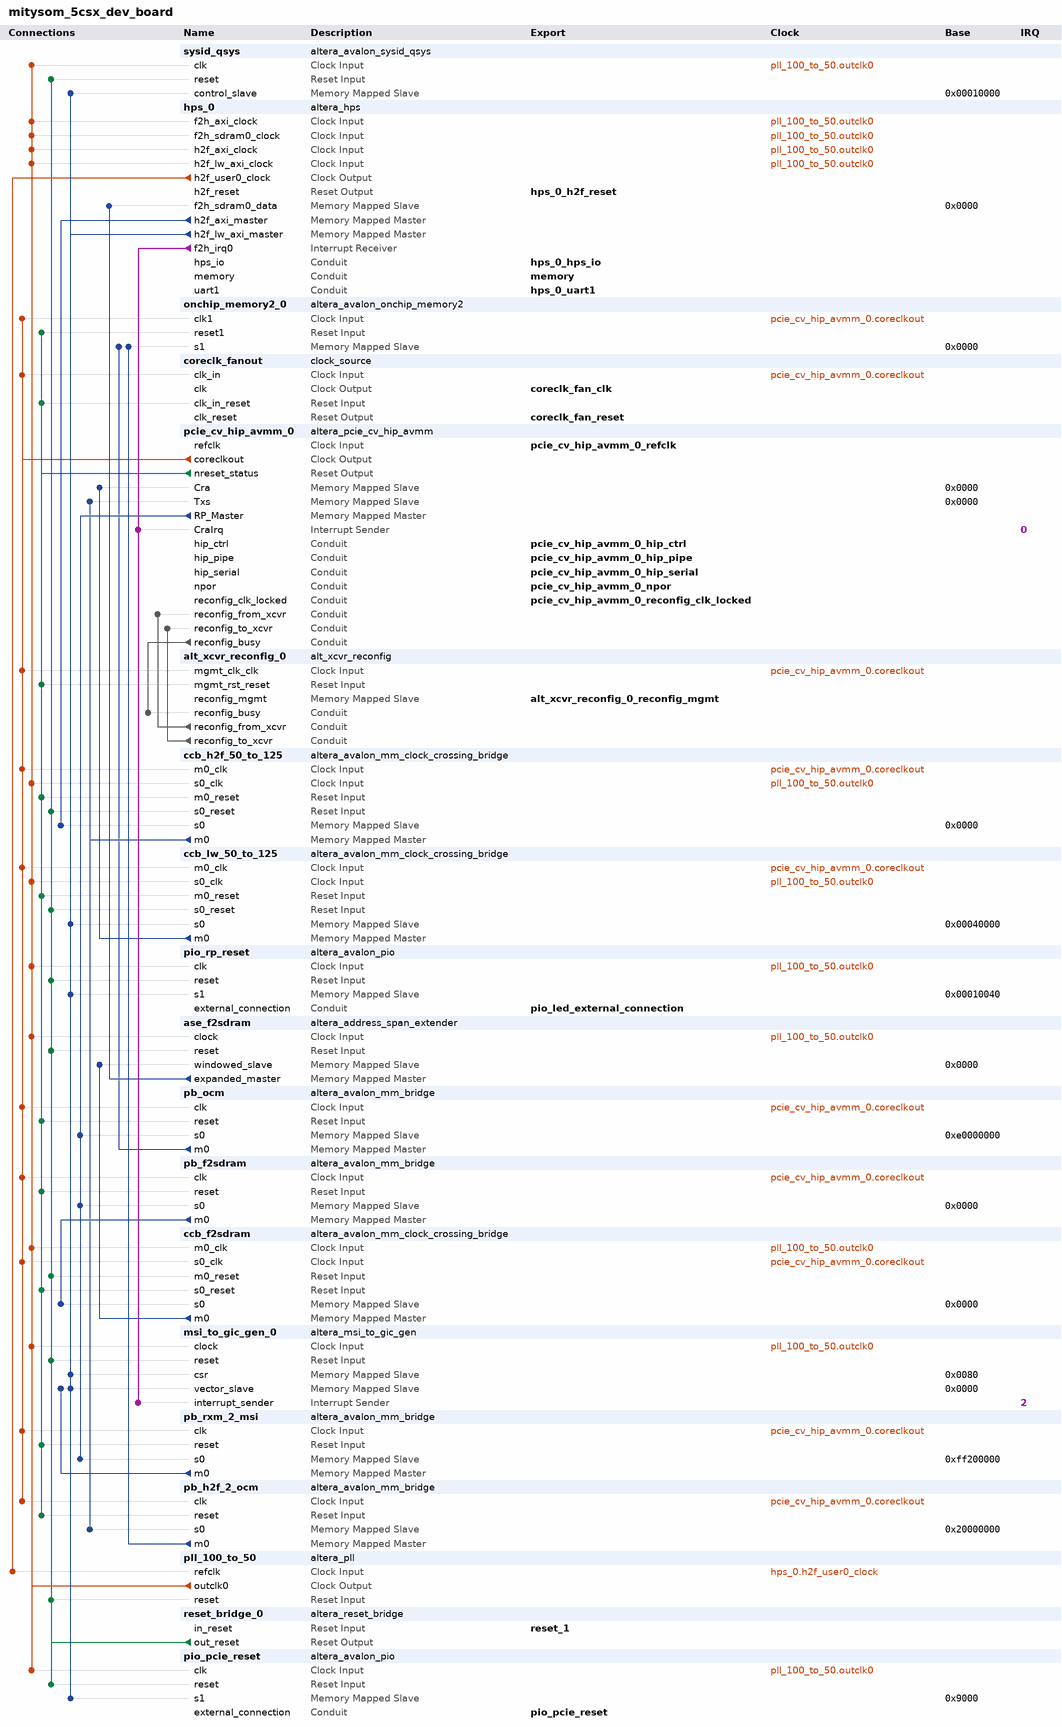
[diagram p0: system contents]
# Platform Designer (Qsys) system mitysom_5csx_dev_board, Cyclone V 5CSXFC6C6U23C7
# Parameters at their usual value, and those the tool derives, are not listed.
package require -exact qsys 13.1
create_system mitysom_5csx_dev_board
set_project_property DEVICE_FAMILY {Cyclone V}
set_project_property DEVICE 5CSXFC6C6U23C7

add_instance sysid_qsys altera_avalon_sysid_qsys 13.1
set_instance_parameter_value sysid_qsys id 65548

add_instance hps_0 altera_hps 13.1
set_instance_parameter_value hps_0 MEM_VENDOR JEDEC
set_instance_parameter_value hps_0 MEM_ROW_ADDR_WIDTH 15
set_instance_parameter_value hps_0 MEM_COL_ADDR_WIDTH 10
set_instance_parameter_value hps_0 MEM_DQ_WIDTH 40
set_instance_parameter_value hps_0 MEM_BANKADDR_WIDTH 3
set_instance_parameter_value hps_0 MEM_DRV_STR RZQ/7
set_instance_parameter_value hps_0 MEM_RTT_NOM {ODT Disabled}
set_instance_parameter_value hps_0 MEM_RTT_WR RZQ/4
set_instance_parameter_value hps_0 MEM_WTCL 6
set_instance_parameter_value hps_0 MEM_TCL 7
set_instance_parameter_value hps_0 TIMING_TIS 175
set_instance_parameter_value hps_0 TIMING_TIH 120
set_instance_parameter_value hps_0 TIMING_TDS 10
set_instance_parameter_value hps_0 TIMING_TDH 45
set_instance_parameter_value hps_0 TIMING_TDQSQ 100
set_instance_parameter_value hps_0 TIMING_TDQSCK 225
set_instance_parameter_value hps_0 TIMING_TDQSS 0.27
set_instance_parameter_value hps_0 TIMING_TQSH 0.4
set_instance_parameter_value hps_0 TIMING_TDSH 0.18
set_instance_parameter_value hps_0 TIMING_TDSS 0.18
set_instance_parameter_value hps_0 MEM_TRAS_NS 35.0
set_instance_parameter_value hps_0 MEM_TRCD_NS 13.75
set_instance_parameter_value hps_0 MEM_TRP_NS 13.75
set_instance_parameter_value hps_0 MEM_TRFC_NS 260.0
set_instance_parameter_value hps_0 MEM_TFAW_NS 30.0
set_instance_parameter_value hps_0 MEM_TRRD_NS 10.0
set_instance_parameter_value hps_0 MEM_TRTP_NS 10.0
set_instance_parameter_value hps_0 REF_CLK_FREQ 25.0
set_instance_parameter_value hps_0 DEFAULT_FAST_SIM_MODEL true
set_instance_parameter_value hps_0 MEM_VOLTAGE {1.35V DDR3L}
set_instance_parameter_value hps_0 TIMING_BOARD_MAX_CK_DELAY 0.6
set_instance_parameter_value hps_0 TIMING_BOARD_MAX_DQS_DELAY 0.2
set_instance_parameter_value hps_0 TIMING_BOARD_SKEW_CKDQS_DIMM_MIN 0.092
set_instance_parameter_value hps_0 TIMING_BOARD_SKEW_CKDQS_DIMM_MAX 0.215
set_instance_parameter_value hps_0 TIMING_BOARD_SKEW_WITHIN_DQS 0.0
set_instance_parameter_value hps_0 TIMING_BOARD_SKEW_BETWEEN_DQS 0.01
set_instance_parameter_value hps_0 TIMING_BOARD_DQ_TO_DQS_SKEW 0.0
set_instance_parameter_value hps_0 TIMING_BOARD_AC_SKEW 0.0
set_instance_parameter_value hps_0 TIMING_BOARD_AC_TO_CK_SKEW 0.0
set_instance_parameter_value hps_0 MEM_CLK_FREQ 400.0
set_instance_parameter_value hps_0 HPS_PROTOCOL DDR3
set_instance_parameter_value hps_0 STM_Enable false
set_instance_parameter_value hps_0 F2S_Width 2
set_instance_parameter_value hps_0 S2F_Width 2
set_instance_parameter_value hps_0 LWH2F_Enable true
set_instance_parameter_value hps_0 F2SDRAM_Type {Avalon-MM Bidirectional}
set_instance_parameter_value hps_0 F2SDRAM_Width 64
set_instance_parameter_value hps_0 F2SCLK_DBGRST_Enable false
set_instance_parameter_value hps_0 F2SCLK_WARMRST_Enable false
set_instance_parameter_value hps_0 F2SCLK_COLDRST_Enable false
set_instance_parameter_value hps_0 F2SINTERRUPT_Enable true
set_instance_parameter_value hps_0 EMAC1_PinMuxing {HPS I/O Set 0}
set_instance_parameter_value hps_0 EMAC1_Mode RGMII
set_instance_parameter_value hps_0 QSPI_PinMuxing {HPS I/O Set 1}
set_instance_parameter_value hps_0 QSPI_Mode {2 SS}
set_instance_parameter_value hps_0 SDIO_PinMuxing {HPS I/O Set 0}
set_instance_parameter_value hps_0 SDIO_Mode {4-bit Data}
set_instance_parameter_value hps_0 USB1_PinMuxing Unused
set_instance_parameter_value hps_0 USB1_Mode N/A
set_instance_parameter_value hps_0 SPIM1_PinMuxing Unused
set_instance_parameter_value hps_0 SPIM1_Mode N/A
set_instance_parameter_value hps_0 UART0_PinMuxing {HPS I/O Set 2}
set_instance_parameter_value hps_0 UART0_Mode {No Flow Control}
set_instance_parameter_value hps_0 UART1_PinMuxing FPGA
set_instance_parameter_value hps_0 UART1_Mode Full
set_instance_parameter_value hps_0 I2C0_PinMuxing {HPS I/O Set 1}
set_instance_parameter_value hps_0 I2C0_Mode I2C
set_instance_parameter_value hps_0 I2C1_PinMuxing {HPS I/O Set 1}
set_instance_parameter_value hps_0 I2C1_Mode I2C
set_instance_parameter_value hps_0 S2FCLK_USER0CLK_Enable true
set_instance_parameter_value hps_0 S2FCLK_USER1CLK_FREQ 100
set_instance_parameter_value hps_0 FPGA_PERIPHERAL_OUTPUT_CLOCK_FREQ_EMAC0_MD_CLK 100
set_instance_parameter_value hps_0 FPGA_PERIPHERAL_OUTPUT_CLOCK_FREQ_EMAC0_GTX_CLK 100
set_instance_parameter_value hps_0 FPGA_PERIPHERAL_OUTPUT_CLOCK_FREQ_EMAC1_MD_CLK 100
set_instance_parameter_value hps_0 FPGA_PERIPHERAL_OUTPUT_CLOCK_FREQ_EMAC1_GTX_CLK 100

add_instance onchip_memory2_0 altera_avalon_onchip_memory2 13.1
set_instance_parameter_value onchip_memory2_0 dataWidth 64
set_instance_parameter_value onchip_memory2_0 dualPort false
set_instance_parameter_value onchip_memory2_0 initMemContent true
set_instance_parameter_value onchip_memory2_0 initializationFileName onchip_memory2_0
set_instance_parameter_value onchip_memory2_0 memorySize 262144

add_instance coreclk_fanout clock_source 13.1
set_instance_parameter_value coreclk_fanout clockFrequency 125000000

add_instance pcie_cv_hip_avmm_0 altera_pcie_cv_hip_avmm 13.1
set_instance_parameter_value pcie_cv_hip_avmm_0 pcie_qsys 1
set_instance_parameter_value pcie_cv_hip_avmm_0 altpcie_avmm_hwtcl 1
set_instance_parameter_value pcie_cv_hip_avmm_0 lane_mask_hwtcl x4
set_instance_parameter_value pcie_cv_hip_avmm_0 gen123_lane_rate_mode_hwtcl {Gen1 (2.5 Gbps)}
set_instance_parameter_value pcie_cv_hip_avmm_0 port_type_hwtcl {Root port}
set_instance_parameter_value pcie_cv_hip_avmm_0 rxbuffer_rxreq_hwtcl Balanced
set_instance_parameter_value pcie_cv_hip_avmm_0 pll_refclk_freq_hwtcl {100 MHz}
set_instance_parameter_value pcie_cv_hip_avmm_0 set_pld_clk_x1_625MHz_hwtcl 0
set_instance_parameter_value pcie_cv_hip_avmm_0 in_cvp_mode_hwtcl 0
set_instance_parameter_value pcie_cv_hip_avmm_0 SLAVE_ADDRESS_MAP_0 0
set_instance_parameter_value pcie_cv_hip_avmm_0 SLAVE_ADDRESS_MAP_1 0
set_instance_parameter_value pcie_cv_hip_avmm_0 SLAVE_ADDRESS_MAP_2 0
set_instance_parameter_value pcie_cv_hip_avmm_0 SLAVE_ADDRESS_MAP_3 0
set_instance_parameter_value pcie_cv_hip_avmm_0 SLAVE_ADDRESS_MAP_4 0
set_instance_parameter_value pcie_cv_hip_avmm_0 SLAVE_ADDRESS_MAP_5 0
set_instance_parameter_value pcie_cv_hip_avmm_0 NUM_PREFETCH_MASTERS 1
set_instance_parameter_value pcie_cv_hip_avmm_0 bar0_type_hwtcl 0
set_instance_parameter_value pcie_cv_hip_avmm_0 bar1_type_hwtcl 0
set_instance_parameter_value pcie_cv_hip_avmm_0 bar2_type_hwtcl 0
set_instance_parameter_value pcie_cv_hip_avmm_0 bar3_type_hwtcl 0
set_instance_parameter_value pcie_cv_hip_avmm_0 bar4_type_hwtcl 0
set_instance_parameter_value pcie_cv_hip_avmm_0 bar5_type_hwtcl 0
set_instance_parameter_value pcie_cv_hip_avmm_0 CB_P2A_AVALON_ADDR_B0 0x00000000
set_instance_parameter_value pcie_cv_hip_avmm_0 CB_P2A_AVALON_ADDR_B1 0x00000000
set_instance_parameter_value pcie_cv_hip_avmm_0 CB_P2A_AVALON_ADDR_B2 0x00000000
set_instance_parameter_value pcie_cv_hip_avmm_0 CB_P2A_AVALON_ADDR_B3 0x00000000
set_instance_parameter_value pcie_cv_hip_avmm_0 CB_P2A_AVALON_ADDR_B4 0x00000000
set_instance_parameter_value pcie_cv_hip_avmm_0 CB_P2A_AVALON_ADDR_B5 0x00000000
set_instance_parameter_value pcie_cv_hip_avmm_0 fixed_address_mode 0
set_instance_parameter_value pcie_cv_hip_avmm_0 CB_P2A_FIXED_AVALON_ADDR_B0 0
set_instance_parameter_value pcie_cv_hip_avmm_0 CB_P2A_FIXED_AVALON_ADDR_B1 0
set_instance_parameter_value pcie_cv_hip_avmm_0 CB_P2A_FIXED_AVALON_ADDR_B2 0
set_instance_parameter_value pcie_cv_hip_avmm_0 CB_P2A_FIXED_AVALON_ADDR_B3 0
set_instance_parameter_value pcie_cv_hip_avmm_0 CB_P2A_FIXED_AVALON_ADDR_B4 0
set_instance_parameter_value pcie_cv_hip_avmm_0 CB_P2A_FIXED_AVALON_ADDR_B5 0
set_instance_parameter_value pcie_cv_hip_avmm_0 vendor_id_hwtcl 4466
set_instance_parameter_value pcie_cv_hip_avmm_0 device_id_hwtcl 57344
set_instance_parameter_value pcie_cv_hip_avmm_0 revision_id_hwtcl 1
set_instance_parameter_value pcie_cv_hip_avmm_0 class_code_hwtcl 394240
set_instance_parameter_value pcie_cv_hip_avmm_0 subsystem_vendor_id_hwtcl 4466
set_instance_parameter_value pcie_cv_hip_avmm_0 subsystem_device_id_hwtcl 57344
set_instance_parameter_value pcie_cv_hip_avmm_0 max_payload_size_hwtcl 256
set_instance_parameter_value pcie_cv_hip_avmm_0 extend_tag_field_hwtcl 32
set_instance_parameter_value pcie_cv_hip_avmm_0 completion_timeout_hwtcl ABCD
set_instance_parameter_value pcie_cv_hip_avmm_0 enable_completion_timeout_disable_hwtcl 1
set_instance_parameter_value pcie_cv_hip_avmm_0 use_aer_hwtcl 0
set_instance_parameter_value pcie_cv_hip_avmm_0 ecrc_check_capable_hwtcl 0
set_instance_parameter_value pcie_cv_hip_avmm_0 ecrc_gen_capable_hwtcl 0
set_instance_parameter_value pcie_cv_hip_avmm_0 use_crc_forwarding_hwtcl 0
set_instance_parameter_value pcie_cv_hip_avmm_0 port_link_number_hwtcl 1
set_instance_parameter_value pcie_cv_hip_avmm_0 dll_active_report_support_hwtcl 0
set_instance_parameter_value pcie_cv_hip_avmm_0 surprise_down_error_support_hwtcl 0
set_instance_parameter_value pcie_cv_hip_avmm_0 slotclkcfg_hwtcl 1
set_instance_parameter_value pcie_cv_hip_avmm_0 msi_multi_message_capable_hwtcl 4
set_instance_parameter_value pcie_cv_hip_avmm_0 msi_64bit_addressing_capable_hwtcl true
set_instance_parameter_value pcie_cv_hip_avmm_0 msi_masking_capable_hwtcl false
set_instance_parameter_value pcie_cv_hip_avmm_0 msi_support_hwtcl true
set_instance_parameter_value pcie_cv_hip_avmm_0 enable_function_msix_support_hwtcl 0
set_instance_parameter_value pcie_cv_hip_avmm_0 msix_table_size_hwtcl 0
set_instance_parameter_value pcie_cv_hip_avmm_0 msix_table_offset_hwtcl 0
set_instance_parameter_value pcie_cv_hip_avmm_0 msix_table_bir_hwtcl 0
set_instance_parameter_value pcie_cv_hip_avmm_0 msix_pba_offset_hwtcl 0
set_instance_parameter_value pcie_cv_hip_avmm_0 msix_pba_bir_hwtcl 0
set_instance_parameter_value pcie_cv_hip_avmm_0 enable_slot_register_hwtcl 0
set_instance_parameter_value pcie_cv_hip_avmm_0 slot_power_scale_hwtcl 0
set_instance_parameter_value pcie_cv_hip_avmm_0 slot_power_limit_hwtcl 0
set_instance_parameter_value pcie_cv_hip_avmm_0 slot_number_hwtcl 0
set_instance_parameter_value pcie_cv_hip_avmm_0 endpoint_l0_latency_hwtcl 0
set_instance_parameter_value pcie_cv_hip_avmm_0 endpoint_l1_latency_hwtcl 0
set_instance_parameter_value pcie_cv_hip_avmm_0 CG_COMMON_CLOCK_MODE 1
set_instance_parameter_value pcie_cv_hip_avmm_0 avmm_width_hwtcl 64
set_instance_parameter_value pcie_cv_hip_avmm_0 AVALON_ADDR_WIDTH 32
set_instance_parameter_value pcie_cv_hip_avmm_0 CB_PCIE_MODE 0
set_instance_parameter_value pcie_cv_hip_avmm_0 CB_PCIE_RX_LITE 0
set_instance_parameter_value pcie_cv_hip_avmm_0 AST_LITE 0
set_instance_parameter_value pcie_cv_hip_avmm_0 CG_RXM_IRQ_NUM 16
set_instance_parameter_value pcie_cv_hip_avmm_0 bypass_tl false
set_instance_parameter_value pcie_cv_hip_avmm_0 CG_IMPL_CRA_AV_SLAVE_PORT 1
set_instance_parameter_value pcie_cv_hip_avmm_0 CG_ENABLE_ADVANCED_INTERRUPT 0
set_instance_parameter_value pcie_cv_hip_avmm_0 CG_ENABLE_A2P_INTERRUPT 0
set_instance_parameter_value pcie_cv_hip_avmm_0 CG_ENABLE_HIP_STATUS 0
set_instance_parameter_value pcie_cv_hip_avmm_0 CG_ENABLE_HIP_STATUS_EXTENSION 0
set_instance_parameter_value pcie_cv_hip_avmm_0 TX_S_ADDR_WIDTH 32
set_instance_parameter_value pcie_cv_hip_avmm_0 CB_A2P_ADDR_MAP_IS_FIXED 0
set_instance_parameter_value pcie_cv_hip_avmm_0 CB_A2P_ADDR_MAP_NUM_ENTRIES 2
set_instance_parameter_value pcie_cv_hip_avmm_0 CB_A2P_ADDR_MAP_PASS_THRU_BITS 28
set_instance_parameter_value pcie_cv_hip_avmm_0 BYPASSS_A2P_TRANSLATION 0
set_instance_parameter_value pcie_cv_hip_avmm_0 CB_RP_S_ADDR_WIDTH 32
set_instance_parameter_value pcie_cv_hip_avmm_0 CB_A2P_ADDR_MAP_FIXED_TABLE_0_HIGH 0
set_instance_parameter_value pcie_cv_hip_avmm_0 CB_A2P_ADDR_MAP_FIXED_TABLE_0_LOW 0
set_instance_parameter_value pcie_cv_hip_avmm_0 CB_A2P_ADDR_MAP_FIXED_TABLE_1_HIGH 0
set_instance_parameter_value pcie_cv_hip_avmm_0 CB_A2P_ADDR_MAP_FIXED_TABLE_1_LOW 0
set_instance_parameter_value pcie_cv_hip_avmm_0 CB_A2P_ADDR_MAP_FIXED_TABLE_2_HIGH 0
set_instance_parameter_value pcie_cv_hip_avmm_0 CB_A2P_ADDR_MAP_FIXED_TABLE_2_LOW 0
set_instance_parameter_value pcie_cv_hip_avmm_0 CB_A2P_ADDR_MAP_FIXED_TABLE_3_HIGH 0
set_instance_parameter_value pcie_cv_hip_avmm_0 CB_A2P_ADDR_MAP_FIXED_TABLE_3_LOW 0
set_instance_parameter_value pcie_cv_hip_avmm_0 CB_A2P_ADDR_MAP_FIXED_TABLE_4_HIGH 0
set_instance_parameter_value pcie_cv_hip_avmm_0 CB_A2P_ADDR_MAP_FIXED_TABLE_4_LOW 0
set_instance_parameter_value pcie_cv_hip_avmm_0 CB_A2P_ADDR_MAP_FIXED_TABLE_5_HIGH 0
set_instance_parameter_value pcie_cv_hip_avmm_0 CB_A2P_ADDR_MAP_FIXED_TABLE_5_LOW 0
set_instance_parameter_value pcie_cv_hip_avmm_0 CB_A2P_ADDR_MAP_FIXED_TABLE_6_HIGH 0
set_instance_parameter_value pcie_cv_hip_avmm_0 CB_A2P_ADDR_MAP_FIXED_TABLE_6_LOW 0
set_instance_parameter_value pcie_cv_hip_avmm_0 CB_A2P_ADDR_MAP_FIXED_TABLE_7_HIGH 0
set_instance_parameter_value pcie_cv_hip_avmm_0 CB_A2P_ADDR_MAP_FIXED_TABLE_7_LOW 0
set_instance_parameter_value pcie_cv_hip_avmm_0 CB_A2P_ADDR_MAP_FIXED_TABLE_8_HIGH 0
set_instance_parameter_value pcie_cv_hip_avmm_0 CB_A2P_ADDR_MAP_FIXED_TABLE_8_LOW 0
set_instance_parameter_value pcie_cv_hip_avmm_0 CB_A2P_ADDR_MAP_FIXED_TABLE_9_HIGH 0
set_instance_parameter_value pcie_cv_hip_avmm_0 CB_A2P_ADDR_MAP_FIXED_TABLE_9_LOW 0
set_instance_parameter_value pcie_cv_hip_avmm_0 CB_A2P_ADDR_MAP_FIXED_TABLE_10_HIGH 0
set_instance_parameter_value pcie_cv_hip_avmm_0 CB_A2P_ADDR_MAP_FIXED_TABLE_10_LOW 0
set_instance_parameter_value pcie_cv_hip_avmm_0 CB_A2P_ADDR_MAP_FIXED_TABLE_11_HIGH 0
set_instance_parameter_value pcie_cv_hip_avmm_0 CB_A2P_ADDR_MAP_FIXED_TABLE_11_LOW 0
set_instance_parameter_value pcie_cv_hip_avmm_0 CB_A2P_ADDR_MAP_FIXED_TABLE_12_HIGH 0
set_instance_parameter_value pcie_cv_hip_avmm_0 CB_A2P_ADDR_MAP_FIXED_TABLE_12_LOW 0
set_instance_parameter_value pcie_cv_hip_avmm_0 CB_A2P_ADDR_MAP_FIXED_TABLE_13_HIGH 0
set_instance_parameter_value pcie_cv_hip_avmm_0 CB_A2P_ADDR_MAP_FIXED_TABLE_13_LOW 0
set_instance_parameter_value pcie_cv_hip_avmm_0 CB_A2P_ADDR_MAP_FIXED_TABLE_14_HIGH 0
set_instance_parameter_value pcie_cv_hip_avmm_0 CB_A2P_ADDR_MAP_FIXED_TABLE_14_LOW 0
set_instance_parameter_value pcie_cv_hip_avmm_0 CB_A2P_ADDR_MAP_FIXED_TABLE_15_HIGH 0
set_instance_parameter_value pcie_cv_hip_avmm_0 CB_A2P_ADDR_MAP_FIXED_TABLE_15_LOW 0
set_instance_parameter_value pcie_cv_hip_avmm_0 {Address Page} "0\\,1\\,2\\,3\\,4\\,5\\,6\\,7\\,8\\,9\\,10\\,11\\,12\\,13\\,14\\,15"
set_instance_parameter_value pcie_cv_hip_avmm_0 {PCIe Address 63:32} "0x00000000\\,0x00000000\\,0x00000000\\,0x00000000\\,0x00000000\\,0x00000000\\,0x00000000\\,0x00000000\\,0x00000000\\,0x00000000\\,0x00000000\\,0x00000000\\,0x00000000\\,0x00000000\\,0x00000000\\,0x00000000"
set_instance_parameter_value pcie_cv_hip_avmm_0 {PCIe Address 31:0} "0x00000000\\,0x00000000\\,0x00000000\\,0x00000000\\,0x00000000\\,0x00000000\\,0x00000000\\,0x00000000\\,0x00000000\\,0x00000000\\,0x00000000\\,0x00000000\\,0x00000000\\,0x00000000\\,0x00000000\\,0x00000000"
set_instance_parameter_value pcie_cv_hip_avmm_0 RXM_DATA_WIDTH 64
set_instance_parameter_value pcie_cv_hip_avmm_0 RXM_BEN_WIDTH 8
set_instance_parameter_value pcie_cv_hip_avmm_0 use_rx_st_be_hwtcl 0
set_instance_parameter_value pcie_cv_hip_avmm_0 use_ast_parity 0
set_instance_parameter_value pcie_cv_hip_avmm_0 force_hrc 0
set_instance_parameter_value pcie_cv_hip_avmm_0 force_src 0
set_instance_parameter_value pcie_cv_hip_avmm_0 bypass_cdc_hwtcl false
set_instance_parameter_value pcie_cv_hip_avmm_0 wrong_device_id_hwtcl disable
set_instance_parameter_value pcie_cv_hip_avmm_0 data_pack_rx_hwtcl disable
set_instance_parameter_value pcie_cv_hip_avmm_0 ltssm_1ms_timeout_hwtcl disable
set_instance_parameter_value pcie_cv_hip_avmm_0 ltssm_freqlocked_check_hwtcl disable
set_instance_parameter_value pcie_cv_hip_avmm_0 deskew_comma_hwtcl skp_eieos_deskw
set_instance_parameter_value pcie_cv_hip_avmm_0 maximum_current_hwtcl 0
set_instance_parameter_value pcie_cv_hip_avmm_0 disable_snoop_packet_hwtcl false
set_instance_parameter_value pcie_cv_hip_avmm_0 enable_l0s_aspm_hwtcl true
set_instance_parameter_value pcie_cv_hip_avmm_0 extended_tag_reset_hwtcl false
set_instance_parameter_value pcie_cv_hip_avmm_0 interrupt_pin_hwtcl inta
set_instance_parameter_value pcie_cv_hip_avmm_0 bridge_port_vga_enable_hwtcl false
set_instance_parameter_value pcie_cv_hip_avmm_0 bridge_port_ssid_support_hwtcl false
set_instance_parameter_value pcie_cv_hip_avmm_0 ssvid_hwtcl 0
set_instance_parameter_value pcie_cv_hip_avmm_0 ssid_hwtcl 0
set_instance_parameter_value pcie_cv_hip_avmm_0 atomic_op_routing_hwtcl false
set_instance_parameter_value pcie_cv_hip_avmm_0 atomic_op_completer_32bit_hwtcl false
set_instance_parameter_value pcie_cv_hip_avmm_0 atomic_op_completer_64bit_hwtcl false
set_instance_parameter_value pcie_cv_hip_avmm_0 cas_completer_128bit_hwtcl false
set_instance_parameter_value pcie_cv_hip_avmm_0 ltr_mechanism_hwtcl false
set_instance_parameter_value pcie_cv_hip_avmm_0 tph_completer_hwtcl false
set_instance_parameter_value pcie_cv_hip_avmm_0 extended_format_field_hwtcl true
set_instance_parameter_value pcie_cv_hip_avmm_0 atomic_malformed_hwtcl true
set_instance_parameter_value pcie_cv_hip_avmm_0 flr_capability_hwtcl 0
set_instance_parameter_value pcie_cv_hip_avmm_0 skp_os_gen3_count_hwtcl 0
set_instance_parameter_value pcie_cv_hip_avmm_0 override_rxbuffer_cred_preset 0
set_instance_parameter_value pcie_cv_hip_avmm_0 coreclkout_hip_phaseshift_hwtcl {0 ps}
set_instance_parameter_value pcie_cv_hip_avmm_0 pldclk_hip_phase_shift_hwtcl {0 ps}
set_instance_parameter_value pcie_cv_hip_avmm_0 serial_sim_hwtcl 0
set_instance_parameter_value pcie_cv_hip_avmm_0 hip_reconfig_hwtcl 0
set_instance_parameter_value pcie_cv_hip_avmm_0 vsec_id_hwtcl 40960
set_instance_parameter_value pcie_cv_hip_avmm_0 vsec_rev_hwtcl 0
set_instance_parameter_value pcie_cv_hip_avmm_0 gen3_rxfreqlock_counter_hwtcl 0
set_instance_parameter_value pcie_cv_hip_avmm_0 expansion_base_address_register_hwtcl 0
set_instance_parameter_value pcie_cv_hip_avmm_0 io_window_addr_width_hwtcl 0
set_instance_parameter_value pcie_cv_hip_avmm_0 prefetchable_mem_window_addr_width_hwtcl 0
set_instance_parameter_value pcie_cv_hip_avmm_0 advanced_default_parameter_override 0
set_instance_parameter_value pcie_cv_hip_avmm_0 override_tbpartner_driver_setting_hwtcl 0
set_instance_parameter_value pcie_cv_hip_avmm_0 enable_rx_buffer_checking_advanced_default_hwtcl false
set_instance_parameter_value pcie_cv_hip_avmm_0 disable_link_x2_support_advanced_default_hwtcl false
set_instance_parameter_value pcie_cv_hip_avmm_0 device_number_advanced_default_hwtcl 0
set_instance_parameter_value pcie_cv_hip_avmm_0 pipex1_debug_sel_advanced_default_hwtcl disable
set_instance_parameter_value pcie_cv_hip_avmm_0 pclk_out_sel_advanced_default_hwtcl pclk
set_instance_parameter_value pcie_cv_hip_avmm_0 no_soft_reset_advanced_default_hwtcl false
set_instance_parameter_value pcie_cv_hip_avmm_0 d1_support_advanced_default_hwtcl false
set_instance_parameter_value pcie_cv_hip_avmm_0 d2_support_advanced_default_hwtcl false
set_instance_parameter_value pcie_cv_hip_avmm_0 d0_pme_advanced_default_hwtcl false
set_instance_parameter_value pcie_cv_hip_avmm_0 d1_pme_advanced_default_hwtcl false
set_instance_parameter_value pcie_cv_hip_avmm_0 d2_pme_advanced_default_hwtcl false
set_instance_parameter_value pcie_cv_hip_avmm_0 d3_hot_pme_advanced_default_hwtcl false
set_instance_parameter_value pcie_cv_hip_avmm_0 d3_cold_pme_advanced_default_hwtcl false
set_instance_parameter_value pcie_cv_hip_avmm_0 low_priority_vc_advanced_default_hwtcl single_vc
set_instance_parameter_value pcie_cv_hip_avmm_0 enable_l1_aspm_advanced_default_hwtcl false
set_instance_parameter_value pcie_cv_hip_avmm_0 l1_exit_latency_sameclock_advanced_default_hwtcl 0
set_instance_parameter_value pcie_cv_hip_avmm_0 l1_exit_latency_diffclock_advanced_default_hwtcl 0
set_instance_parameter_value pcie_cv_hip_avmm_0 hot_plug_support_advanced_default_hwtcl 0
set_instance_parameter_value pcie_cv_hip_avmm_0 no_command_completed_advanced_default_hwtcl false
set_instance_parameter_value pcie_cv_hip_avmm_0 eie_before_nfts_count_advanced_default_hwtcl 4
set_instance_parameter_value pcie_cv_hip_avmm_0 gen2_diffclock_nfts_count_advanced_default_hwtcl 255
set_instance_parameter_value pcie_cv_hip_avmm_0 gen2_sameclock_nfts_count_advanced_default_hwtcl 255
set_instance_parameter_value pcie_cv_hip_avmm_0 deemphasis_enable_advanced_default_hwtcl false
set_instance_parameter_value pcie_cv_hip_avmm_0 l0_exit_latency_sameclock_advanced_default_hwtcl 6
set_instance_parameter_value pcie_cv_hip_avmm_0 l0_exit_latency_diffclock_advanced_default_hwtcl 6
set_instance_parameter_value pcie_cv_hip_avmm_0 vc0_clk_enable_advanced_default_hwtcl true
set_instance_parameter_value pcie_cv_hip_avmm_0 register_pipe_signals_advanced_default_hwtcl true
set_instance_parameter_value pcie_cv_hip_avmm_0 tx_cdc_almost_empty_advanced_default_hwtcl 5
set_instance_parameter_value pcie_cv_hip_avmm_0 rx_l0s_count_idl_advanced_default_hwtcl 0
set_instance_parameter_value pcie_cv_hip_avmm_0 cdc_dummy_insert_limit_advanced_default_hwtcl 11
set_instance_parameter_value pcie_cv_hip_avmm_0 ei_delay_powerdown_count_advanced_default_hwtcl 10
set_instance_parameter_value pcie_cv_hip_avmm_0 skp_os_schedule_count_advanced_default_hwtcl 0
set_instance_parameter_value pcie_cv_hip_avmm_0 fc_init_timer_advanced_default_hwtcl 1024
set_instance_parameter_value pcie_cv_hip_avmm_0 l01_entry_latency_advanced_default_hwtcl 31
set_instance_parameter_value pcie_cv_hip_avmm_0 flow_control_update_count_advanced_default_hwtcl 30
set_instance_parameter_value pcie_cv_hip_avmm_0 flow_control_timeout_count_advanced_default_hwtcl 200
set_instance_parameter_value pcie_cv_hip_avmm_0 retry_buffer_last_active_address_advanced_default_hwtcl 255
set_instance_parameter_value pcie_cv_hip_avmm_0 reserved_debug_advanced_default_hwtcl 0
set_instance_parameter_value pcie_cv_hip_avmm_0 use_tl_cfg_sync_advanced_default_hwtcl 1
set_instance_parameter_value pcie_cv_hip_avmm_0 diffclock_nfts_count_advanced_default_hwtcl 255
set_instance_parameter_value pcie_cv_hip_avmm_0 sameclock_nfts_count_advanced_default_hwtcl 255
set_instance_parameter_value pcie_cv_hip_avmm_0 l2_async_logic_advanced_default_hwtcl disable
set_instance_parameter_value pcie_cv_hip_avmm_0 rx_cdc_almost_full_advanced_default_hwtcl 12
set_instance_parameter_value pcie_cv_hip_avmm_0 tx_cdc_almost_full_advanced_default_hwtcl 11
set_instance_parameter_value pcie_cv_hip_avmm_0 indicator_advanced_default_hwtcl 0
set_instance_parameter_value pcie_cv_hip_avmm_0 rpre_emph_a_val_hwtcl 11
set_instance_parameter_value pcie_cv_hip_avmm_0 rpre_emph_b_val_hwtcl 0
set_instance_parameter_value pcie_cv_hip_avmm_0 rpre_emph_c_val_hwtcl 22
set_instance_parameter_value pcie_cv_hip_avmm_0 rpre_emph_d_val_hwtcl 12
set_instance_parameter_value pcie_cv_hip_avmm_0 rpre_emph_e_val_hwtcl 21
set_instance_parameter_value pcie_cv_hip_avmm_0 rvod_sel_a_val_hwtcl 50
set_instance_parameter_value pcie_cv_hip_avmm_0 rvod_sel_b_val_hwtcl 34
set_instance_parameter_value pcie_cv_hip_avmm_0 rvod_sel_c_val_hwtcl 50
set_instance_parameter_value pcie_cv_hip_avmm_0 rvod_sel_d_val_hwtcl 50
set_instance_parameter_value pcie_cv_hip_avmm_0 rvod_sel_e_val_hwtcl 9

add_instance alt_xcvr_reconfig_0 alt_xcvr_reconfig 13.1
set_instance_parameter_value alt_xcvr_reconfig_0 device_family {Cyclone V}
set_instance_parameter_value alt_xcvr_reconfig_0 number_of_reconfig_interfaces 5
set_instance_parameter_value alt_xcvr_reconfig_0 enable_analog 1
set_instance_parameter_value alt_xcvr_reconfig_0 enable_adce 0

add_instance ccb_h2f_50_to_125 altera_avalon_mm_clock_crossing_bridge 13.1
set_instance_parameter_value ccb_h2f_50_to_125 DATA_WIDTH 64
set_instance_parameter_value ccb_h2f_50_to_125 ADDRESS_WIDTH 30
set_instance_parameter_value ccb_h2f_50_to_125 MAX_BURST_SIZE 32
set_instance_parameter_value ccb_h2f_50_to_125 COMMAND_FIFO_DEPTH 128
set_instance_parameter_value ccb_h2f_50_to_125 RESPONSE_FIFO_DEPTH 128
set_instance_parameter_value ccb_h2f_50_to_125 MASTER_SYNC_DEPTH 16
set_instance_parameter_value ccb_h2f_50_to_125 SLAVE_SYNC_DEPTH 16

add_instance ccb_lw_50_to_125 altera_avalon_mm_clock_crossing_bridge 13.1
set_instance_parameter_value ccb_lw_50_to_125 DATA_WIDTH 32
set_instance_parameter_value ccb_lw_50_to_125 ADDRESS_WIDTH 15
set_instance_parameter_value ccb_lw_50_to_125 MAX_BURST_SIZE 1
set_instance_parameter_value ccb_lw_50_to_125 COMMAND_FIFO_DEPTH 2
set_instance_parameter_value ccb_lw_50_to_125 RESPONSE_FIFO_DEPTH 2
set_instance_parameter_value ccb_lw_50_to_125 MASTER_SYNC_DEPTH 2
set_instance_parameter_value ccb_lw_50_to_125 SLAVE_SYNC_DEPTH 2

add_instance pio_rp_reset altera_avalon_pio 13.1
set_instance_parameter_value pio_rp_reset direction InOut
set_instance_parameter_value pio_rp_reset width 1

add_instance ase_f2sdram altera_address_span_extender 1.2
set_instance_parameter_value ase_f2sdram DATA_WIDTH 64
set_instance_parameter_value ase_f2sdram SLAVE_ADDRESS_WIDTH 28
set_instance_parameter_value ase_f2sdram BURSTCOUNT_WIDTH 7
set_instance_parameter_value ase_f2sdram MASTER_ADDRESS_DEF 0
set_instance_parameter_value ase_f2sdram TERMINATE_SLAVE_PORT true
set_instance_parameter_value ase_f2sdram MAX_PENDING_READS 2

add_instance pb_ocm altera_avalon_mm_bridge 13.1
set_instance_parameter_value pb_ocm DATA_WIDTH 64
set_instance_parameter_value pb_ocm ADDRESS_WIDTH 18
set_instance_parameter_value pb_ocm ADDRESS_UNITS SYMBOLS
set_instance_parameter_value pb_ocm MAX_BURST_SIZE 64
set_instance_parameter_value pb_ocm MAX_PENDING_RESPONSES 4

add_instance pb_f2sdram altera_avalon_mm_bridge 13.1
set_instance_parameter_value pb_f2sdram DATA_WIDTH 64
set_instance_parameter_value pb_f2sdram ADDRESS_WIDTH 31
set_instance_parameter_value pb_f2sdram ADDRESS_UNITS SYMBOLS
set_instance_parameter_value pb_f2sdram MAX_BURST_SIZE 64
set_instance_parameter_value pb_f2sdram MAX_PENDING_RESPONSES 4

add_instance ccb_f2sdram altera_avalon_mm_clock_crossing_bridge 13.1
set_instance_parameter_value ccb_f2sdram DATA_WIDTH 64
set_instance_parameter_value ccb_f2sdram ADDRESS_WIDTH 31
set_instance_parameter_value ccb_f2sdram MAX_BURST_SIZE 64
set_instance_parameter_value ccb_f2sdram COMMAND_FIFO_DEPTH 4
set_instance_parameter_value ccb_f2sdram RESPONSE_FIFO_DEPTH 128
set_instance_parameter_value ccb_f2sdram MASTER_SYNC_DEPTH 2
set_instance_parameter_value ccb_f2sdram SLAVE_SYNC_DEPTH 2

add_instance msi_to_gic_gen_0 altera_msi_to_gic_gen 1.0
set_instance_parameter_value msi_to_gic_gen_0 MSG_DATA_WORD 1
set_instance_parameter_value msi_to_gic_gen_0 DATA_ENTRY_DEPTH 1
set_instance_parameter_value msi_to_gic_gen_0 MEMORY_TYPE {RAM_BLOCK_TYPE=MLAB}

add_instance pb_rxm_2_msi altera_avalon_mm_bridge 13.1
set_instance_parameter_value pb_rxm_2_msi DATA_WIDTH 32
set_instance_parameter_value pb_rxm_2_msi ADDRESS_WIDTH 7
set_instance_parameter_value pb_rxm_2_msi ADDRESS_UNITS SYMBOLS
set_instance_parameter_value pb_rxm_2_msi MAX_PENDING_RESPONSES 2

add_instance pb_h2f_2_ocm altera_avalon_mm_bridge 13.1
set_instance_parameter_value pb_h2f_2_ocm DATA_WIDTH 64
set_instance_parameter_value pb_h2f_2_ocm ADDRESS_WIDTH 18
set_instance_parameter_value pb_h2f_2_ocm ADDRESS_UNITS SYMBOLS
set_instance_parameter_value pb_h2f_2_ocm MAX_BURST_SIZE 64
set_instance_parameter_value pb_h2f_2_ocm MAX_PENDING_RESPONSES 4

add_instance pll_100_to_50 altera_pll 13.1
set_instance_parameter_value pll_100_to_50 gui_device_speed_grade 7
set_instance_parameter_value pll_100_to_50 gui_pll_mode {Integer-N PLL}
set_instance_parameter_value pll_100_to_50 gui_reference_clock_frequency 100.0
set_instance_parameter_value pll_100_to_50 gui_operation_mode direct
set_instance_parameter_value pll_100_to_50 gui_use_locked true
set_instance_parameter_value pll_100_to_50 gui_number_of_clocks 1
set_instance_parameter_value pll_100_to_50 gui_output_clock_frequency0 50.0

add_instance reset_bridge_0 altera_reset_bridge 13.1
set_instance_parameter_value reset_bridge_0 ACTIVE_LOW_RESET 1
set_instance_parameter_value reset_bridge_0 SYNCHRONOUS_EDGES none

add_instance pio_pcie_reset altera_avalon_pio 13.1
set_instance_parameter_value pio_pcie_reset direction Output
set_instance_parameter_value pio_pcie_reset width 1

# connections
add_connection hps_0.h2f_user0_clock pll_100_to_50.refclk clock
add_connection pcie_cv_hip_avmm_0.coreclkout alt_xcvr_reconfig_0.mgmt_clk_clk clock
add_connection pcie_cv_hip_avmm_0.coreclkout ccb_f2sdram.s0_clk clock
add_connection pcie_cv_hip_avmm_0.coreclkout ccb_h2f_50_to_125.m0_clk clock
add_connection pcie_cv_hip_avmm_0.coreclkout ccb_lw_50_to_125.m0_clk clock
add_connection pcie_cv_hip_avmm_0.coreclkout coreclk_fanout.clk_in clock
add_connection pcie_cv_hip_avmm_0.coreclkout onchip_memory2_0.clk1 clock
add_connection pcie_cv_hip_avmm_0.coreclkout pb_f2sdram.clk clock
add_connection pcie_cv_hip_avmm_0.coreclkout pb_h2f_2_ocm.clk clock
add_connection pcie_cv_hip_avmm_0.coreclkout pb_ocm.clk clock
add_connection pcie_cv_hip_avmm_0.coreclkout pb_rxm_2_msi.clk clock
add_connection pll_100_to_50.outclk0 ase_f2sdram.clock clock
add_connection pll_100_to_50.outclk0 ccb_f2sdram.m0_clk clock
add_connection pll_100_to_50.outclk0 ccb_h2f_50_to_125.s0_clk clock
add_connection pll_100_to_50.outclk0 ccb_lw_50_to_125.s0_clk clock
add_connection pll_100_to_50.outclk0 hps_0.f2h_axi_clock clock
add_connection pll_100_to_50.outclk0 hps_0.f2h_sdram0_clock clock
add_connection pll_100_to_50.outclk0 hps_0.h2f_axi_clock clock
add_connection pll_100_to_50.outclk0 hps_0.h2f_lw_axi_clock clock
add_connection pll_100_to_50.outclk0 msi_to_gic_gen_0.clock clock
add_connection pll_100_to_50.outclk0 pio_pcie_reset.clk clock
add_connection pll_100_to_50.outclk0 pio_rp_reset.clk clock
add_connection pll_100_to_50.outclk0 sysid_qsys.clk clock
add_connection pcie_cv_hip_avmm_0.nreset_status alt_xcvr_reconfig_0.mgmt_rst_reset reset
add_connection pcie_cv_hip_avmm_0.nreset_status ccb_f2sdram.s0_reset reset
add_connection pcie_cv_hip_avmm_0.nreset_status ccb_h2f_50_to_125.m0_reset reset
add_connection pcie_cv_hip_avmm_0.nreset_status ccb_lw_50_to_125.m0_reset reset
add_connection pcie_cv_hip_avmm_0.nreset_status coreclk_fanout.clk_in_reset reset
add_connection pcie_cv_hip_avmm_0.nreset_status onchip_memory2_0.reset1 reset
add_connection pcie_cv_hip_avmm_0.nreset_status pb_f2sdram.reset reset
add_connection pcie_cv_hip_avmm_0.nreset_status pb_h2f_2_ocm.reset reset
add_connection pcie_cv_hip_avmm_0.nreset_status pb_ocm.reset reset
add_connection pcie_cv_hip_avmm_0.nreset_status pb_rxm_2_msi.reset reset
add_connection reset_bridge_0.out_reset ase_f2sdram.reset reset
add_connection reset_bridge_0.out_reset ccb_f2sdram.m0_reset reset
add_connection reset_bridge_0.out_reset ccb_h2f_50_to_125.s0_reset reset
add_connection reset_bridge_0.out_reset ccb_lw_50_to_125.s0_reset reset
add_connection reset_bridge_0.out_reset msi_to_gic_gen_0.reset reset
add_connection reset_bridge_0.out_reset pio_pcie_reset.reset reset
add_connection reset_bridge_0.out_reset pio_rp_reset.reset reset
add_connection reset_bridge_0.out_reset pll_100_to_50.reset reset
add_connection reset_bridge_0.out_reset sysid_qsys.reset reset
add_connection ase_f2sdram.expanded_master hps_0.f2h_sdram0_data avalon
set_connection_parameter_value ase_f2sdram.expanded_master/hps_0.f2h_sdram0_data baseAddress 0x0000
add_connection ccb_f2sdram.m0 ase_f2sdram.windowed_slave avalon
set_connection_parameter_value ccb_f2sdram.m0/ase_f2sdram.windowed_slave baseAddress 0x0000
add_connection ccb_h2f_50_to_125.m0 pb_h2f_2_ocm.s0 avalon
set_connection_parameter_value ccb_h2f_50_to_125.m0/pb_h2f_2_ocm.s0 baseAddress 0x20000000
add_connection ccb_h2f_50_to_125.m0 pcie_cv_hip_avmm_0.Txs avalon
set_connection_parameter_value ccb_h2f_50_to_125.m0/pcie_cv_hip_avmm_0.Txs baseAddress 0x0000
add_connection ccb_lw_50_to_125.m0 pcie_cv_hip_avmm_0.Cra avalon
set_connection_parameter_value ccb_lw_50_to_125.m0/pcie_cv_hip_avmm_0.Cra baseAddress 0x0000
add_connection hps_0.h2f_axi_master ccb_h2f_50_to_125.s0 avalon
set_connection_parameter_value hps_0.h2f_axi_master/ccb_h2f_50_to_125.s0 baseAddress 0x0000
add_connection hps_0.h2f_lw_axi_master ccb_lw_50_to_125.s0 avalon
set_connection_parameter_value hps_0.h2f_lw_axi_master/ccb_lw_50_to_125.s0 baseAddress 0x00040000
add_connection hps_0.h2f_lw_axi_master msi_to_gic_gen_0.csr avalon
set_connection_parameter_value hps_0.h2f_lw_axi_master/msi_to_gic_gen_0.csr baseAddress 0x0080
add_connection hps_0.h2f_lw_axi_master msi_to_gic_gen_0.vector_slave avalon
set_connection_parameter_value hps_0.h2f_lw_axi_master/msi_to_gic_gen_0.vector_slave baseAddress 0x0000
add_connection hps_0.h2f_lw_axi_master pio_pcie_reset.s1 avalon
set_connection_parameter_value hps_0.h2f_lw_axi_master/pio_pcie_reset.s1 baseAddress 0x9000
add_connection hps_0.h2f_lw_axi_master pio_rp_reset.s1 avalon
set_connection_parameter_value hps_0.h2f_lw_axi_master/pio_rp_reset.s1 baseAddress 0x00010040
add_connection hps_0.h2f_lw_axi_master sysid_qsys.control_slave avalon
set_connection_parameter_value hps_0.h2f_lw_axi_master/sysid_qsys.control_slave baseAddress 0x00010000
add_connection pb_f2sdram.m0 ccb_f2sdram.s0 avalon
set_connection_parameter_value pb_f2sdram.m0/ccb_f2sdram.s0 baseAddress 0x0000
add_connection pb_h2f_2_ocm.m0 onchip_memory2_0.s1 avalon
set_connection_parameter_value pb_h2f_2_ocm.m0/onchip_memory2_0.s1 baseAddress 0x0000
add_connection pb_ocm.m0 onchip_memory2_0.s1 avalon
set_connection_parameter_value pb_ocm.m0/onchip_memory2_0.s1 baseAddress 0x0000
add_connection pb_rxm_2_msi.m0 msi_to_gic_gen_0.vector_slave avalon
set_connection_parameter_value pb_rxm_2_msi.m0/msi_to_gic_gen_0.vector_slave baseAddress 0x0000
add_connection pcie_cv_hip_avmm_0.RP_Master pb_f2sdram.s0 avalon
set_connection_parameter_value pcie_cv_hip_avmm_0.RP_Master/pb_f2sdram.s0 baseAddress 0x0000
add_connection pcie_cv_hip_avmm_0.RP_Master pb_ocm.s0 avalon
set_connection_parameter_value pcie_cv_hip_avmm_0.RP_Master/pb_ocm.s0 baseAddress 0xe0000000
add_connection pcie_cv_hip_avmm_0.RP_Master pb_rxm_2_msi.s0 avalon
set_connection_parameter_value pcie_cv_hip_avmm_0.RP_Master/pb_rxm_2_msi.s0 baseAddress 0xff200000
add_connection alt_xcvr_reconfig_0.reconfig_from_xcvr pcie_cv_hip_avmm_0.reconfig_from_xcvr conduit
add_connection alt_xcvr_reconfig_0.reconfig_to_xcvr pcie_cv_hip_avmm_0.reconfig_to_xcvr conduit
add_connection pcie_cv_hip_avmm_0.reconfig_busy alt_xcvr_reconfig_0.reconfig_busy conduit
add_connection hps_0.f2h_irq0 msi_to_gic_gen_0.interrupt_sender interrupt
set_connection_parameter_value hps_0.f2h_irq0/msi_to_gic_gen_0.interrupt_sender irqNumber 2
add_connection hps_0.f2h_irq0 pcie_cv_hip_avmm_0.CraIrq interrupt
set_connection_parameter_value hps_0.f2h_irq0/pcie_cv_hip_avmm_0.CraIrq irqNumber 0

# exported interfaces
add_interface memory conduit end
set_interface_property memory EXPORT_OF hps_0.memory
add_interface hps_0_hps_io conduit end
set_interface_property hps_0_hps_io EXPORT_OF hps_0.hps_io
add_interface hps_0_h2f_reset reset source
set_interface_property hps_0_h2f_reset EXPORT_OF hps_0.h2f_reset
add_interface pcie_cv_hip_avmm_0_refclk clock sink
set_interface_property pcie_cv_hip_avmm_0_refclk EXPORT_OF pcie_cv_hip_avmm_0.refclk
add_interface pcie_cv_hip_avmm_0_hip_ctrl conduit end
set_interface_property pcie_cv_hip_avmm_0_hip_ctrl EXPORT_OF pcie_cv_hip_avmm_0.hip_ctrl
add_interface pcie_cv_hip_avmm_0_hip_serial conduit end
set_interface_property pcie_cv_hip_avmm_0_hip_serial EXPORT_OF pcie_cv_hip_avmm_0.hip_serial
add_interface pcie_cv_hip_avmm_0_reconfig_clk_locked conduit end
set_interface_property pcie_cv_hip_avmm_0_reconfig_clk_locked EXPORT_OF pcie_cv_hip_avmm_0.reconfig_clk_locked
add_interface pcie_cv_hip_avmm_0_hip_pipe conduit end
set_interface_property pcie_cv_hip_avmm_0_hip_pipe EXPORT_OF pcie_cv_hip_avmm_0.hip_pipe
add_interface pcie_cv_hip_avmm_0_npor conduit end
set_interface_property pcie_cv_hip_avmm_0_npor EXPORT_OF pcie_cv_hip_avmm_0.npor
add_interface coreclk_fan_clk clock source
set_interface_property coreclk_fan_clk EXPORT_OF coreclk_fanout.clk
add_interface coreclk_fan_reset reset source
set_interface_property coreclk_fan_reset EXPORT_OF coreclk_fanout.clk_reset
add_interface alt_xcvr_reconfig_0_reconfig_mgmt avalon slave
set_interface_property alt_xcvr_reconfig_0_reconfig_mgmt EXPORT_OF alt_xcvr_reconfig_0.reconfig_mgmt
add_interface pio_led_external_connection conduit end
set_interface_property pio_led_external_connection EXPORT_OF pio_rp_reset.external_connection
add_interface reset_1 reset sink
set_interface_property reset_1 EXPORT_OF reset_bridge_0.in_reset
add_interface pio_pcie_reset conduit end
set_interface_property pio_pcie_reset EXPORT_OF pio_pcie_reset.external_connection
add_interface hps_0_uart1 conduit end
set_interface_property hps_0_uart1 EXPORT_OF hps_0.uart1

set_interconnect_requirement {$system} qsys_mm.clockCrossingAdapter HANDSHAKE
set_interconnect_requirement {$system} qsys_mm.maxAdditionalLatency 0
set_interconnect_requirement {$system} qsys_mm.insertDefaultSlave false

save_system mitysom_5csx_dev_board.qsys
